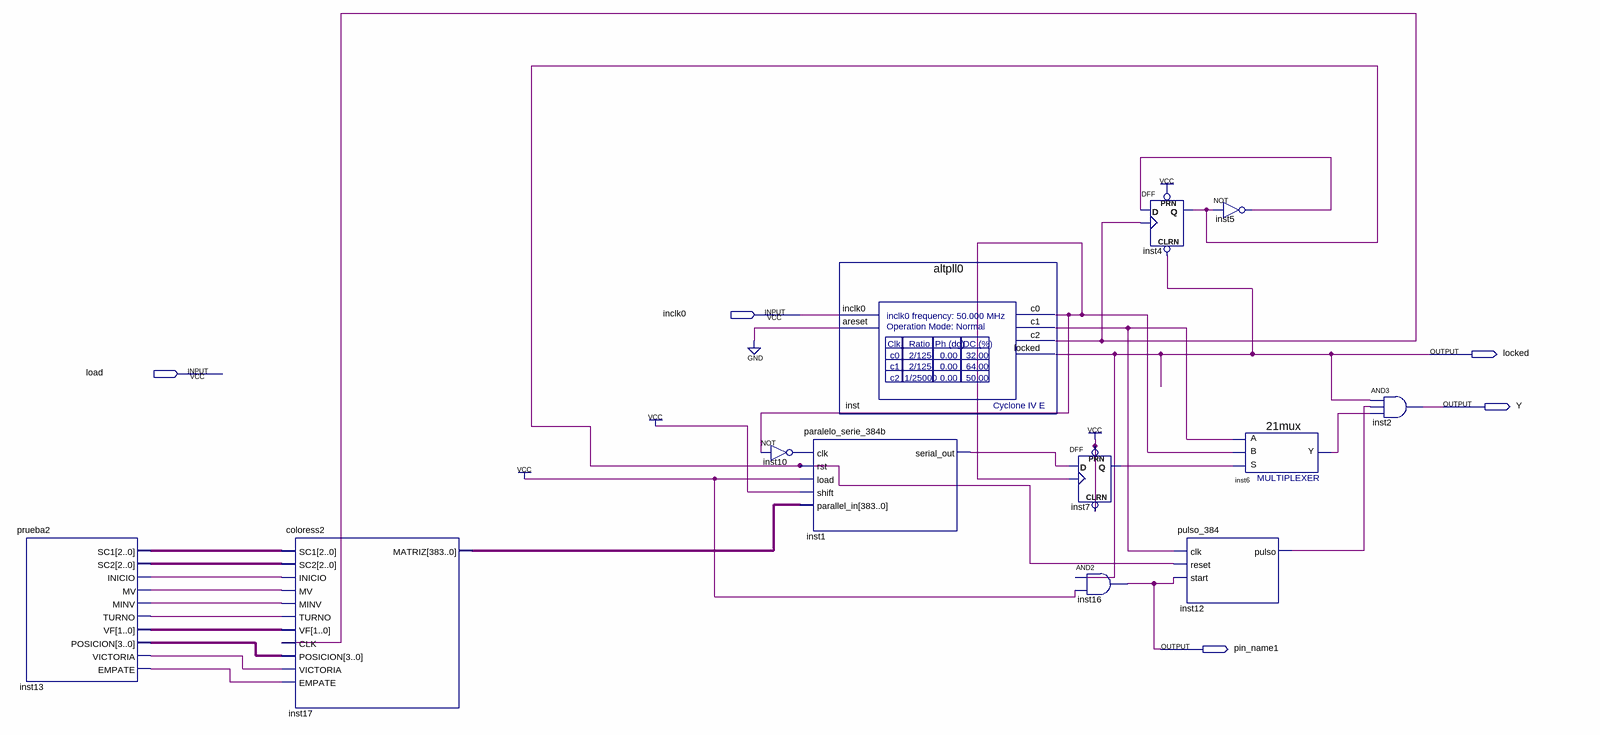
[diagram p0: schematic sheet]
// Quartus schematic Block1.bdf as structural Verilog: 12 symbols, 5 pins
module Block1 (
  input  inclk0,
  input  load,
  output locked,
  output Y,
  output pin_name1
);

  wire inst1_serial_out, inst4_q, inst5_out, inst6_y, inst7_q, inst10_out, inst12_pulso, inst13_empate,
       inst13_inicio, inst13_minv, inst13_mv, inst13_turno, inst13_victoria, inst_c0, inst_c1, inst_c2;
  wire [1:0] inst13_vf;
  wire [2:0] inst13_sc1, inst13_sc2;
  wire [3:0] inst13_posicion;
  wire [383:0] inst17_matriz;

  prueba2 inst13 (
    .SC1(inst13_sc1), .SC2(inst13_sc2), .INICIO(inst13_inicio), .MV(inst13_mv), .MINV(inst13_minv),
    .TURNO(inst13_turno), .VF(inst13_vf), .POSICION(inst13_posicion), .VICTORIA(inst13_victoria),
    .EMPATE(inst13_empate));
  coloress2 inst17 (
    .SC1(inst13_sc1), .SC2(inst13_sc2), .INICIO(inst13_inicio), .MV(inst13_mv), .MINV(inst13_minv),
    .TURNO(inst13_turno), .VF(inst13_vf), .CLK(inst_c2), .POSICION(inst13_posicion),
    .VICTORIA(inst13_victoria), .EMPATE(inst13_empate), .MATRIZ(inst17_matriz));
  not inst10 (inst10_out, inst_c0);
  paralelo_serie_384b inst1 (
    .clk(inst10_out), .rst(inst4_q), .load(1'b1), .shift(1'b1), .parallel_in(inst17_matriz),
    .serial_out(inst1_serial_out));
  altpll0 inst (.inclk0(inclk0), .areset(1'b0), .c0(inst_c0), .c1(inst_c1), .c2(inst_c2), .locked(locked));
  DFF inst7 (.CLRN(1'b1), .CLK(inst_c0), .D(inst1_serial_out), .PRN(1'b1), .Q(inst7_q));
  and inst16 (pin_name1, locked, 1'b1);
  DFF inst4 (.CLRN(locked), .CLK(inst_c2), .D(inst5_out), .PRN(1'b1), .Q(inst4_q));
  pulso_384 inst12 (.clk(inst_c1), .reset(inst4_q), .start(pin_name1), .pulso(inst12_pulso));
  not inst5 (inst5_out, inst4_q);
  \21mux  inst6 (.S(inst7_q), .B(inst_c0), .A(inst_c1), .Y(inst6_y));
  and inst2 (Y, locked, inst12_pulso, inst6_y);
endmodule
